# EAGLE design distribution_board (EAGLE 6.4)
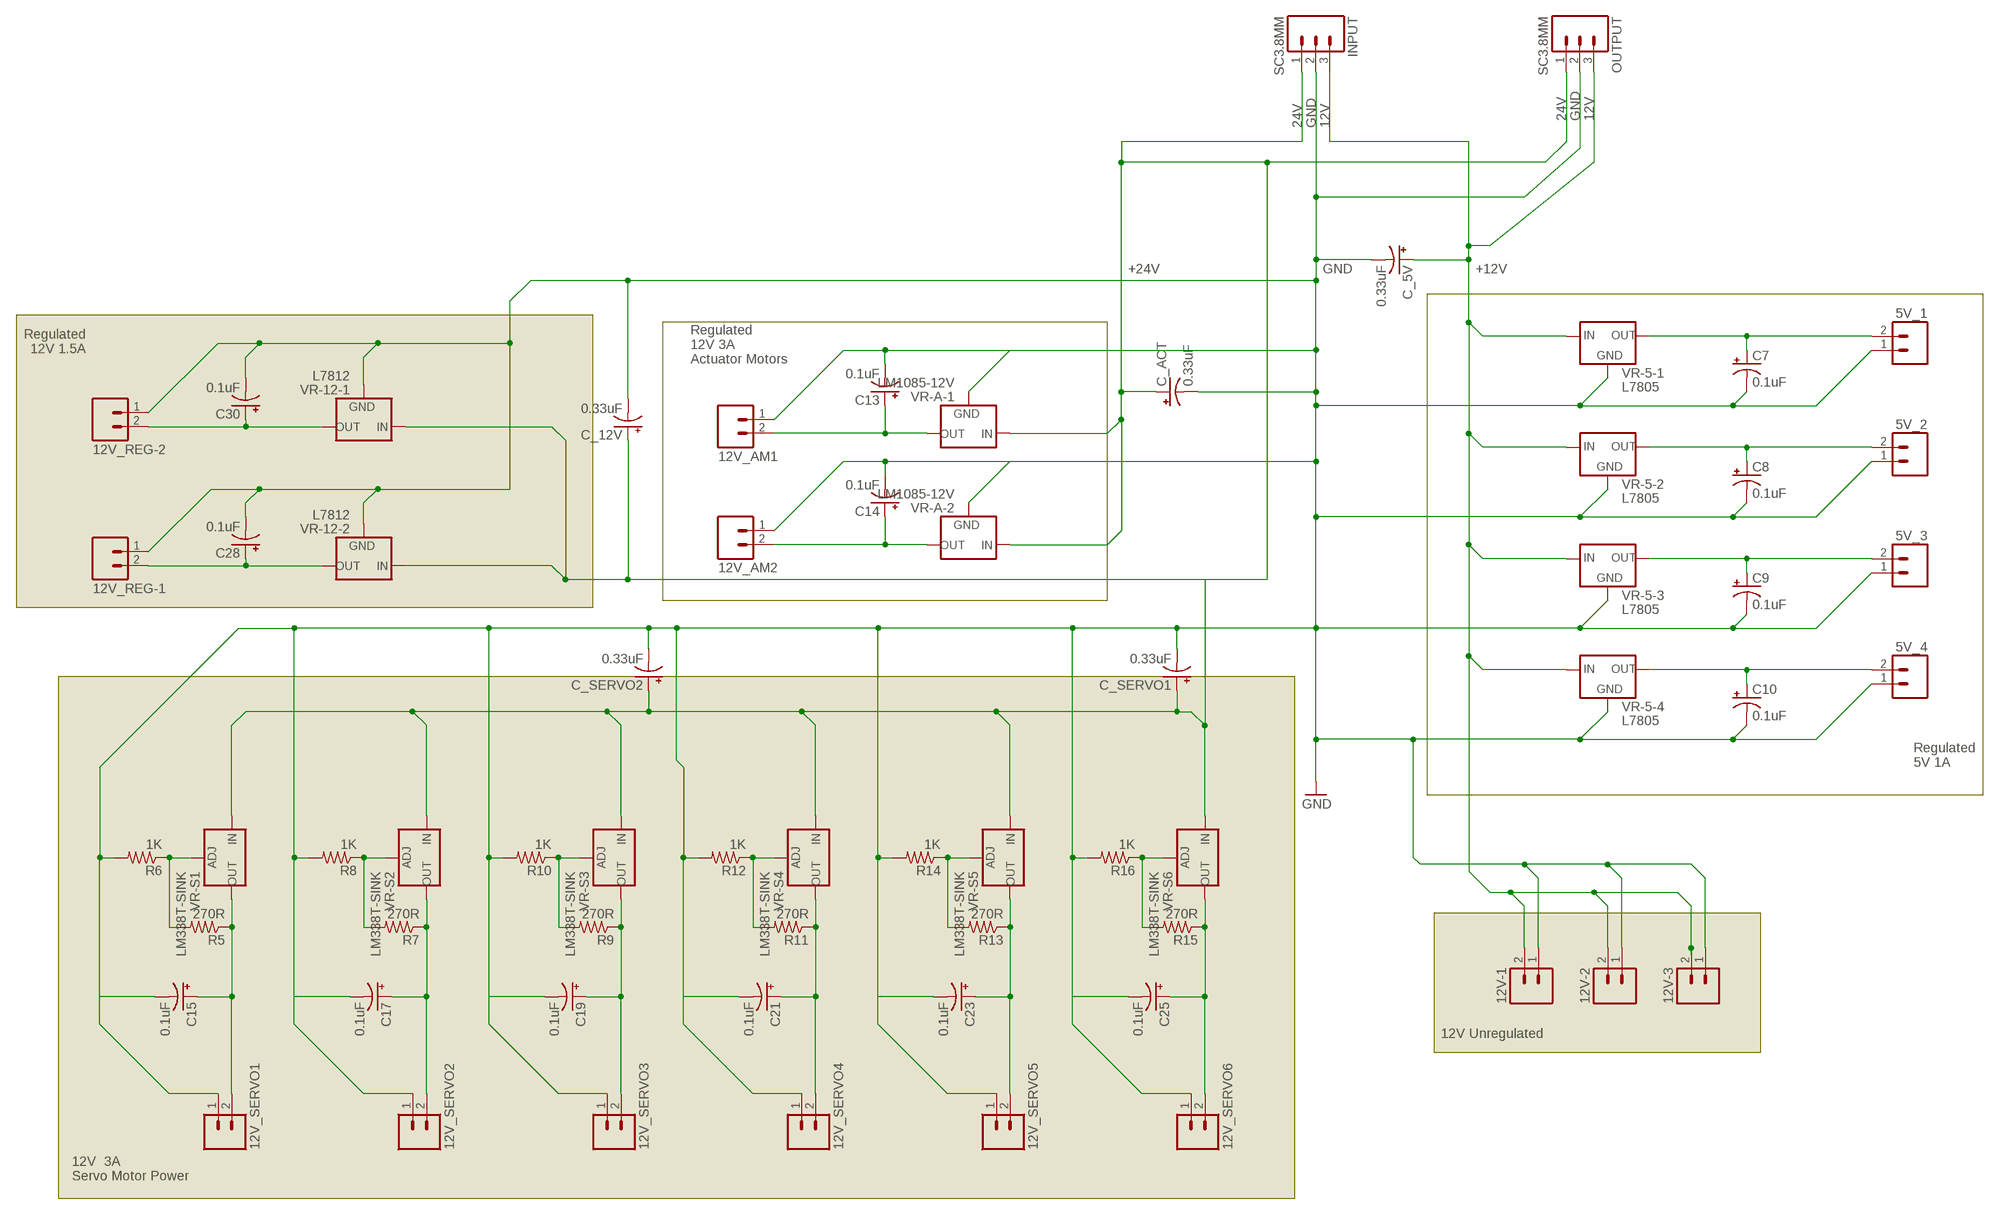
[diagram p0: schematic, sheet 1]

## Parts
5V_1  SC3.81MM  2-HOLESSC3.81MM  [SCREWTERMINAL-3.81MM]
5V_2  SC3.81MM  2-HOLESSC3.81MM  [SCREWTERMINAL-3.81MM]
5V_3  SC3.81MM  2-HOLESSC3.81MM  [SCREWTERMINAL-3.81MM]
5V_4  SC3.81MM  2-HOLESSC3.81MM  [SCREWTERMINAL-3.81MM]
12V-1  SC3.81MM  2-HOLESSC3.81MM  [SCREWTERMINAL-3.81MM]
12V-2  SC3.81MM  2-HOLESSC3.81MM  [SCREWTERMINAL-3.81MM]
12V-3  SC3.81MM  2-HOLESSC3.81MM  [SCREWTERMINAL-3.81MM]
12V_AM1  SC3.81MM  2-HOLESSC3.81MM  [SCREWTERMINAL-3.81MM]
12V_AM2  SC3.81MM  2-HOLESSC3.81MM  [SCREWTERMINAL-3.81MM]
12V_REG-1  SC3.81MM  2-HOLESSC3.81MM  [SCREWTERMINAL-3.81MM]
12V_REG-2  SC3.81MM  2-HOLESSC3.81MM  [SCREWTERMINAL-3.81MM]
12V_SERVO1  SC3.81MM  2-HOLESSC3.81MM  [SCREWTERMINAL-3.81MM]
12V_SERVO2  SC3.81MM  2-HOLESSC3.81MM  [SCREWTERMINAL-3.81MM]
12V_SERVO3  SC3.81MM  2-HOLESSC3.81MM  [SCREWTERMINAL-3.81MM]
12V_SERVO4  SC3.81MM  2-HOLESSC3.81MM  [SCREWTERMINAL-3.81MM]
12V_SERVO5  SC3.81MM  2-HOLESSC3.81MM  [SCREWTERMINAL-3.81MM]
12V_SERVO6  SC3.81MM  2-HOLESSC3.81MM  [SCREWTERMINAL-3.81MM]
C7  0.1uF  CAPACITOR_POL  [E2,5-5]
C8  0.1uF  CAPACITOR_POL  [E2,5-5]
C9  0.1uF  CAPACITOR_POL  [E2,5-5]
C10  0.1uF  CAPACITOR_POL  [E2,5-5]
C13  0.1uF  CAPACITOR_POL  [E2,5-5]
C14  0.1uF  CAPACITOR_POL  [E2,5-5]
C15  0.1uF  CAPACITOR_POL  [E2,5-5]
C17  0.1uF  CAPACITOR_POL  [E2,5-5]
C19  0.1uF  CAPACITOR_POL  [E2,5-5]
C21  0.1uF  CAPACITOR_POL  [E2,5-5]
C23  0.1uF  CAPACITOR_POL  [E2,5-5]
C25  0.1uF  CAPACITOR_POL  [E2,5-5]
C28  0.1uF  CAPACITOR_POL  [E2,5-5]
C30  0.1uF  CAPACITOR_POL  [E2,5-5]
C_5V  0.33uF  CAPACITOR_POL  [E2,5-5]
C_12V  0.33uF  CAPACITOR_POL  [E2,5-5]
C_ACT  0.33uF  CAPACITOR_POL  [E2,5-5]
C_SERVO1  0.33uF  CAPACITOR_POL  [E2,5-5]
C_SERVO2  0.33uF  CAPACITOR_POL  [E2,5-5]
INPUT  SC3.8MM  3-HOLES  [SCREWTERMINAL-5MM-3]
OUTPUT  SC3.8MM  3-HOLES  [SCREWTERMINAL-5MM-3]
R5  270R  RESISTOR0207/2V  [0207/2V]
R6  1K  RESISTOR0207/2V  [0207/2V]
R7  270R  RESISTOR0207/2V  [0207/2V]
R8  1K  RESISTOR0207/2V  [0207/2V]
R9  270R  RESISTOR0207/2V  [0207/2V]
R10  1K  RESISTOR0207/2V  [0207/2V]
R11  270R  RESISTOR0207/2V  [0207/2V]
R12  1K  RESISTOR0207/2V  [0207/2V]
R13  270R  RESISTOR0207/2V  [0207/2V]
R14  1K  RESISTOR0207/2V  [0207/2V]
R15  270R  RESISTOR0207/2V  [0207/2V]
R16  1K  RESISTOR0207/2V  [0207/2V]
VR-5-1  L7805  L7805ACD2T-TR  [TO263]
VR-5-2  L7805  L7805ACD2T-TR  [TO263]
VR-5-3  L7805  L7805ACD2T-TR  [TO263]
VR-5-4  L7805  L7805ACD2T-TR  [TO263]
VR-12-1  L7812  L7812CD2T-TRTO-263  [TO263]
VR-12-2  L7812  L7812CD2T-TRTO-263  [TO263]
VR-A-1  LM1085-12V  LM1085IT-SINK  [TO220V-HEATSINK]
VR-A-2  LM1085-12V  LM1085IT-SINK  [TO220V-HEATSINK]
VR-S1  LM338T-SINK  [TO220V-HEATSINK]
VR-S2  LM338T-SINK  [TO220V-HEATSINK]
VR-S3  LM338T-SINK  [TO220V-HEATSINK]
VR-S4  LM338T-SINK  [TO220V-HEATSINK]
VR-S5  LM338T-SINK  [TO220V-HEATSINK]
VR-S6  LM338T-SINK  [TO220V-HEATSINK]

## Nets
12V [power]: 12V-1.2 12V-2.2 12V-3.2 C_5V.+ INPUT.3 OUTPUT.3 VR-5-1.1(IN) VR-5-2.1(IN) VR-5-3.1(IN) VR-5-4.1(IN)
24V [power]: C_12V.+ C_ACT.+ C_SERVO1.+ C_SERVO2.+ INPUT.1 OUTPUT.1 VR-12-1.1(IN) VR-12-2.1(IN) VR-A-1.3(IN) VR-A-2.3(IN) VR-S1.3(IN) VR-S2.3(IN) VR-S3.3(IN) VR-S4.3(IN) VR-S5.3(IN) VR-S6.3(IN)
GND [ground]: 5V_1.1 5V_2.1 5V_3.1 5V_4.1 12V-1.1 12V-2.1 12V-3.1 12V_AM1.1 12V_AM2.1 12V_REG-1.1 12V_REG-2.1 12V_SERVO1.1 12V_SERVO2.1 12V_SERVO3.1 12V_SERVO4.1 12V_SERVO5.1 12V_SERVO6.1 C7.- C8.- C9.- C10.- C13.- C14.- C15.- C17.- C19.- C21.- C23.- C25.- C28.- C30.- C_5V.- C_12V.- C_ACT.- C_SERVO1.- C_SERVO2.- INPUT.2 OUTPUT.2 R6.2 R8.2 R10.2 R12.2 R14.2 R16.2 VR-5-1.3(GND) VR-5-2.3(GND) VR-5-3.3(GND) VR-5-4.3(GND) VR-12-1.3(GND) VR-12-2.3(GND) VR-A-1.1(GND) VR-A-2.1(GND)
N$3 [power]: 12V_REG-1.2 C28.+ VR-12-2.2(OUT)
N$7 [power]: 5V_1.2 C7.+ VR-5-1.2(OUT)
N$13 [power]: 5V_2.2 C8.+ VR-5-2.2(OUT)
N$14 [power]: 5V_3.2 C9.+ VR-5-3.2(OUT)
N$15 [power]: 5V_4.2 C10.+ VR-5-4.2(OUT)
N$17: 12V_AM1.2 C13.+ VR-A-1.2(OUT)
N$18 [power]: 12V_AM2.2 C14.+ VR-A-2.2(OUT)
N$19: R5.2 R6.1 VR-S1.1(ADJ)
N$21 [power]: 12V_REG-2.2 C30.+ VR-12-1.2(OUT)
N$23 [power]: 12V_SERVO1.2 C15.+ R5.1 VR-S1.2(OUT)
N$25 [power]: 12V_SERVO2.2 C17.+ R7.1 VR-S2.2(OUT)
N$26: R7.2 R8.1 VR-S2.1(ADJ)
N$28 [power]: 12V_SERVO3.2 C19.+ R9.1 VR-S3.2(OUT)
N$29: R9.2 R10.1 VR-S3.1(ADJ)
N$31 [power]: 12V_SERVO4.2 C21.+ R11.1 VR-S4.2(OUT)
N$32: R11.2 R12.1 VR-S4.1(ADJ)
N$34 [power]: 12V_SERVO5.2 C23.+ R13.1 VR-S5.2(OUT)
N$35: R13.2 R14.1 VR-S5.1(ADJ)
N$37 [power]: 12V_SERVO6.2 C25.+ R15.1 VR-S6.2(OUT)
N$38: R15.2 R16.1 VR-S6.1(ADJ)

## Notes on the sheet
- +24V | GND | +12V
- Regulated
  12V 1.5A
- Regulated
  12V 3A
  Actuator Motors
- Regulated
  5V 1A
- 12V Unregulated
- 12V  3A
  Servo Motor Power

## Library data of the parts
5V_1-5V_4 12V-1-12V-3 12V_AM1 12V_AM2 12V_REG-1 12V_REG-2 12V_SERVO1-12V_SERVO6 = parts:2-HOLES: TERMINAL 2-PIN Holes for connecting 2 pin terminal
C7-C10 C13-C15 C17 C19 C21 C23 C25 C28 C30 C_5V C_12V C_ACT C_SERVO1 C_SERVO2 = parts:CAPACITOR_POL: POLARIZED CAPACITOR, American symbol
INPUT OUTPUT = parts:3-HOLES: TERMINAL 3-PIN
R5-R16 = parts:RESISTOR: RESISTOR
VR-5-1-VR-5-4 = parts:L7805ACD2T-TR: VOLTAGE REGULATOR 5V 1A surface mount voltage regulator
VR-12-1 VR-12-2 = parts:L7812CD2T-TR: VOLTAGE REGULATOR 12V 1.5A voltage regulator
VR-A-1 VR-A-2 = parts:LM1085IT: VOLTAGE REGULATOR 12V 3A voltage regulator
VR-S1-VR-S6 = parts:LM338T: VOLTAGE REGULATOR Adjustable 1.2V to 32V 5A voltage regulator

## Net classes
1 ground: width 0.813 mm, clearance 0.508 mm
2 power: width 0.61 mm, clearance 0.508 mm

## Board
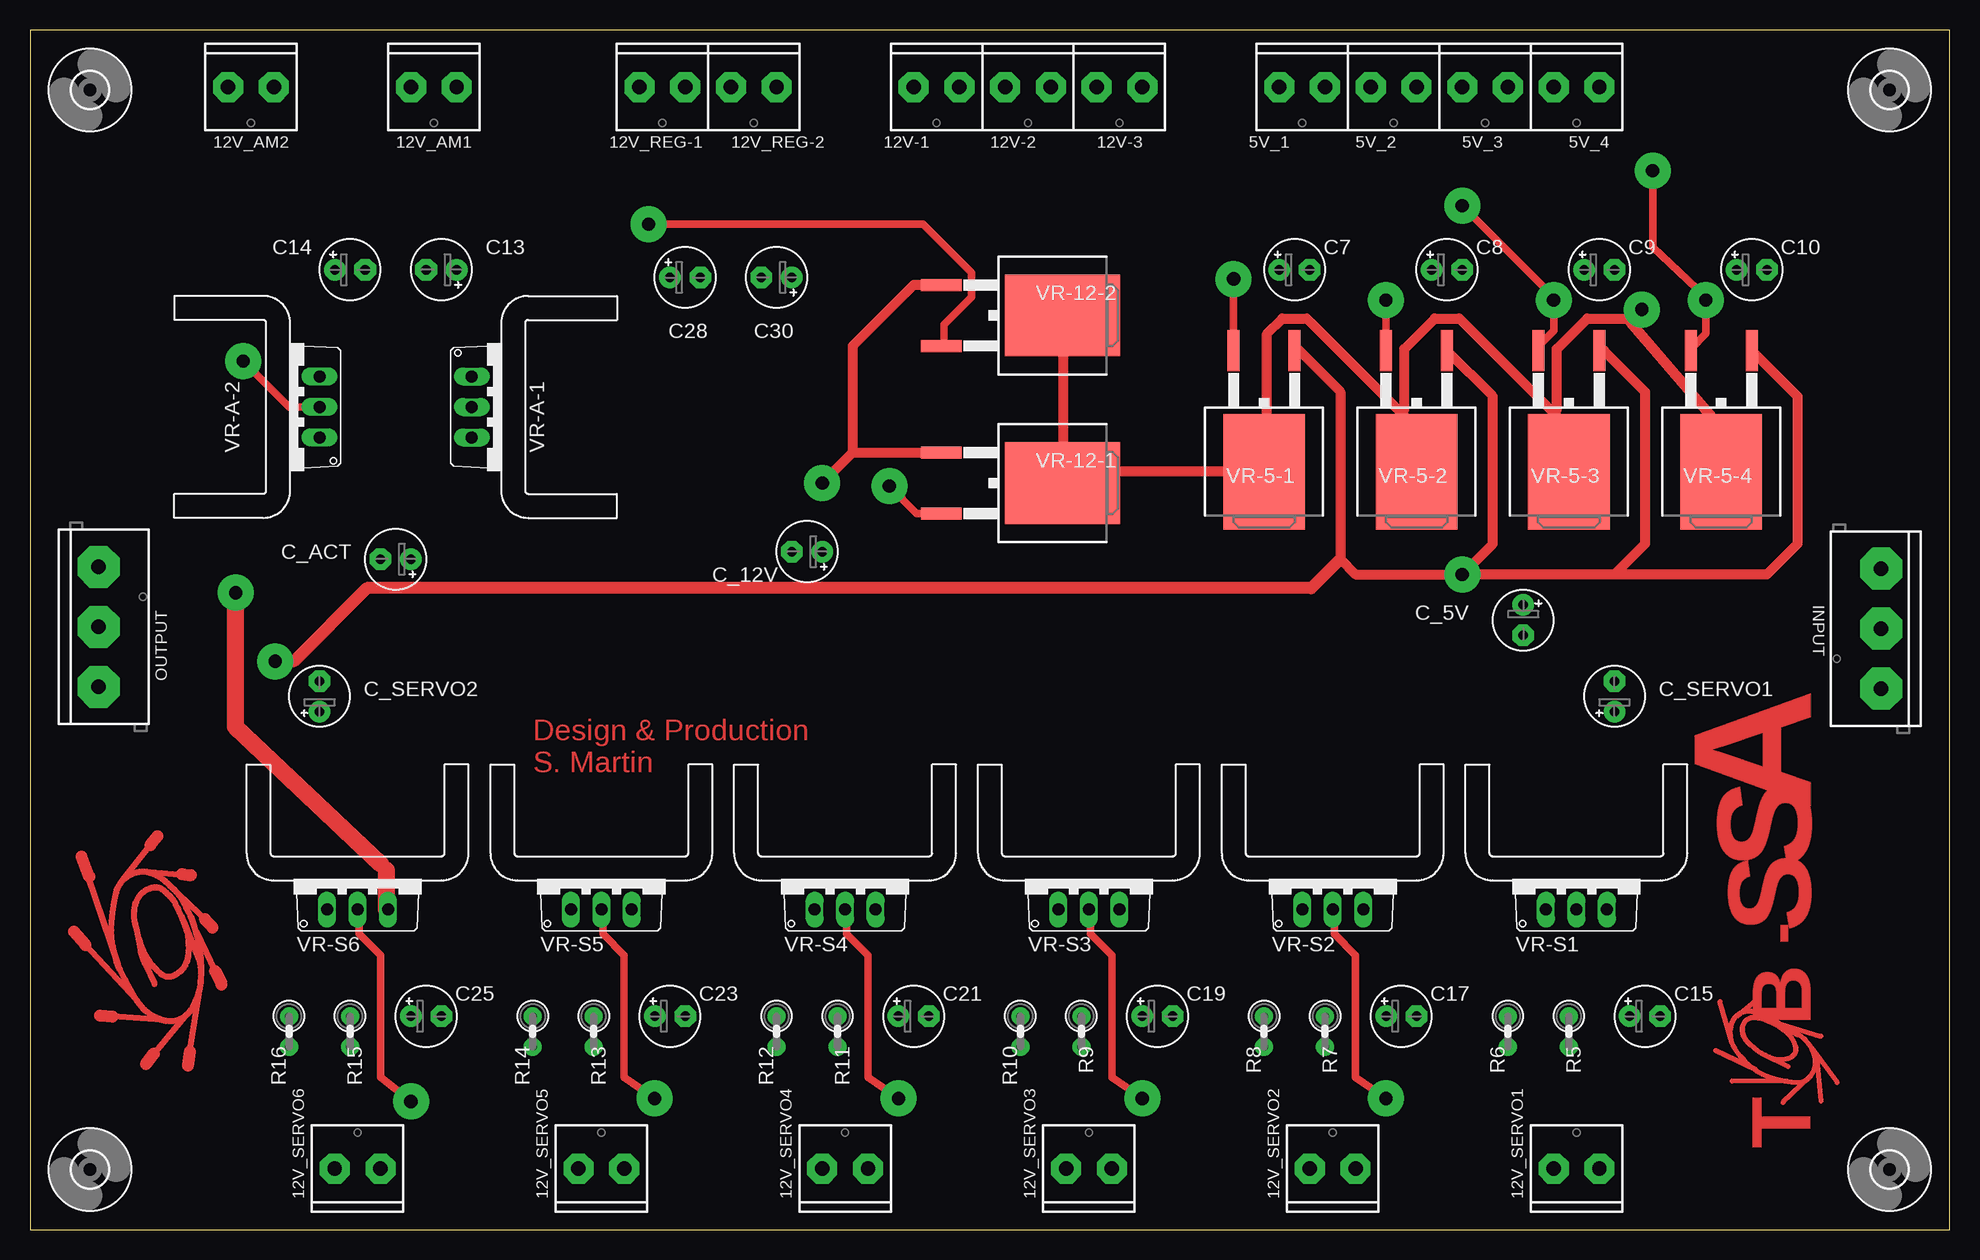
[diagram p1: board, top side]
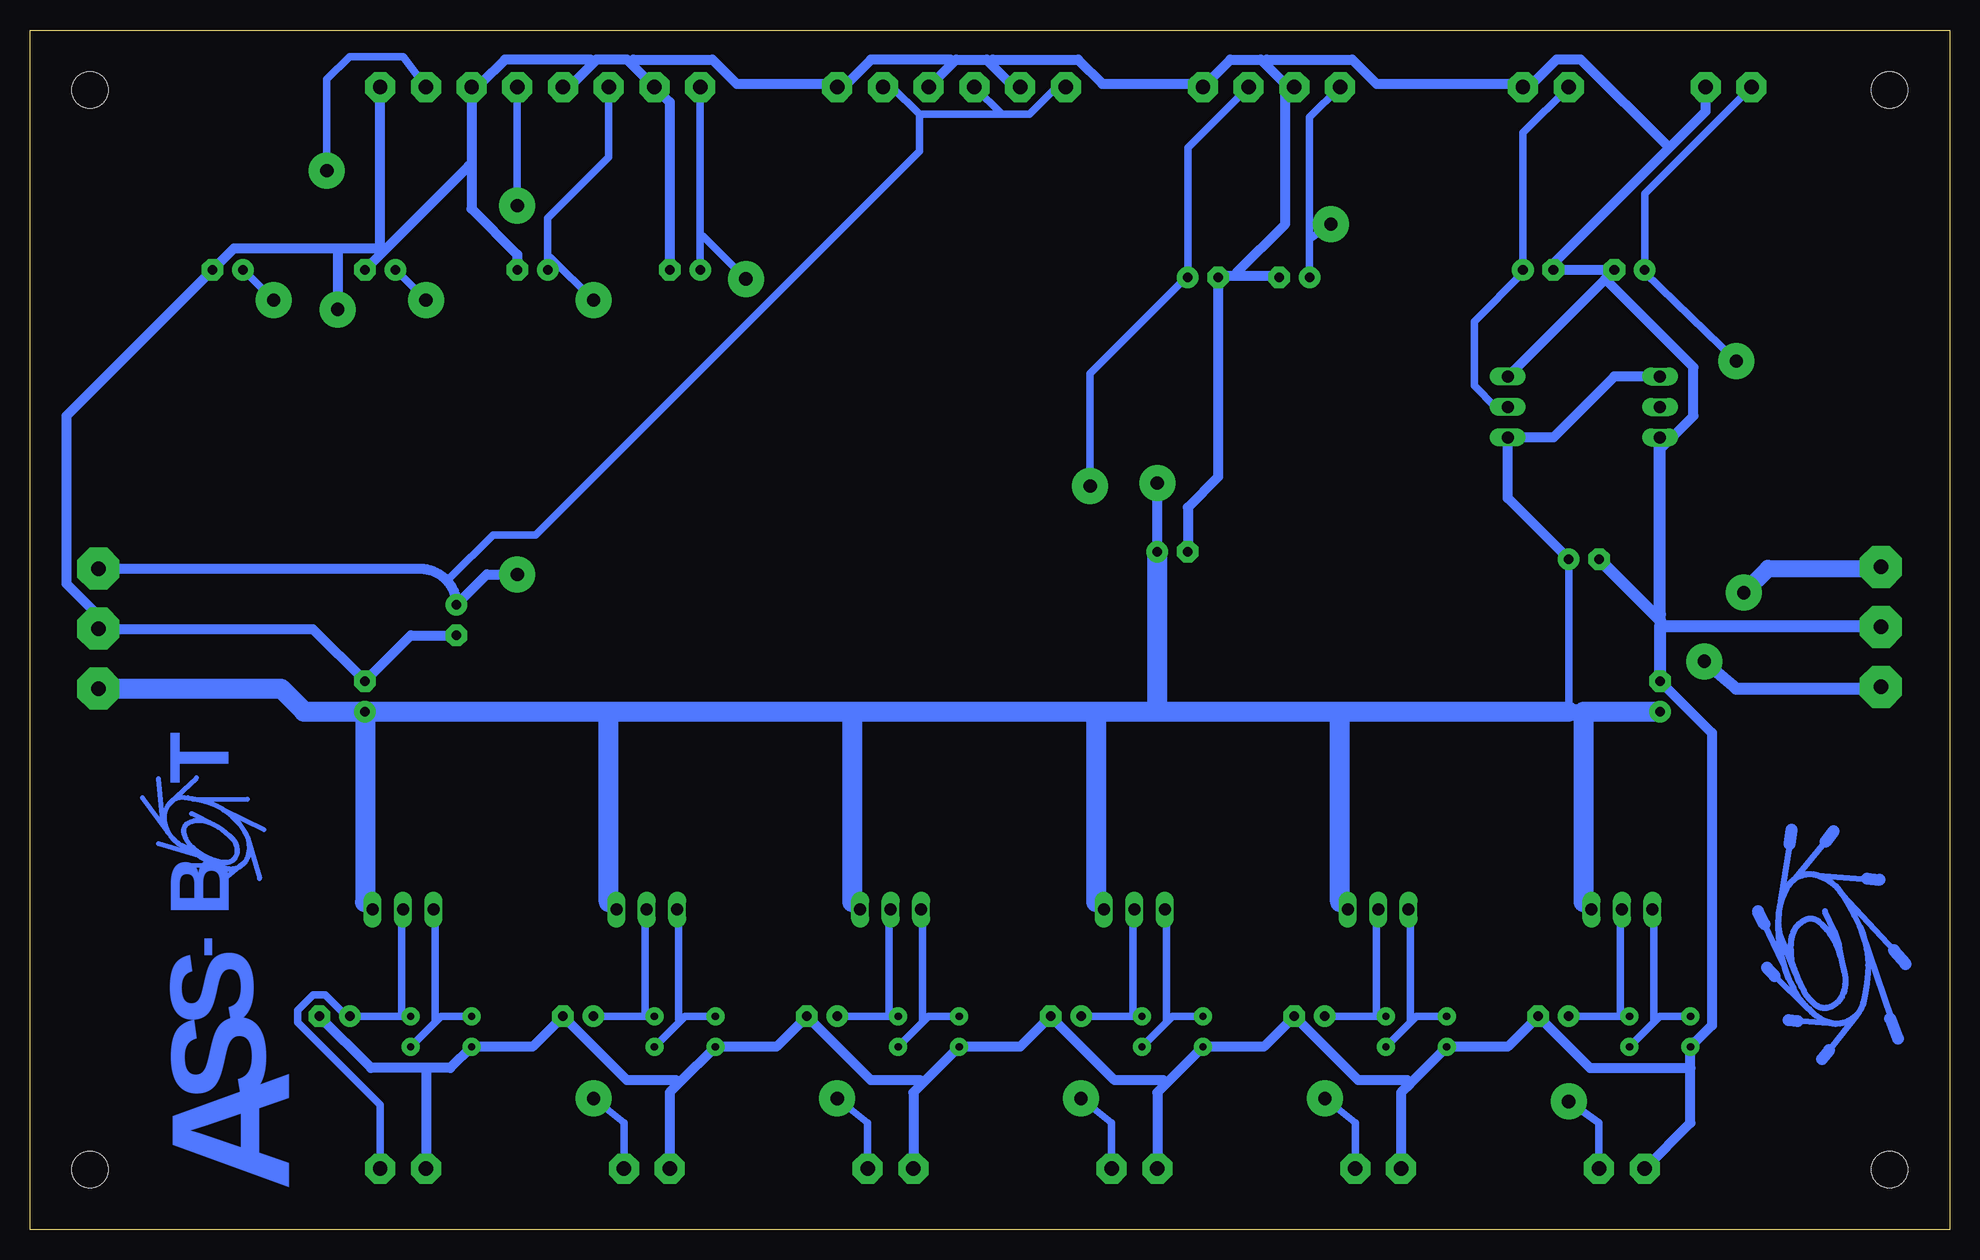
[diagram p2: board, bottom side, seen from below]

Size 160 x 100 mm. Coordinates in mm from the lower left corner, seen from the top.
Outline: 0,0 160,0 160,100 0,100 0,0
Copper layers (1*16): Top 0.035mm / dielectric 1.5mm / Bottom 0.035mm
Design rules "rules *": minimum track width 24mil, minimum drill 1.1mm, track to track 20mil, track to pad 20mil, pad to pad 30mil, via to via 50mil, smd to smd 8mil, copper to edge 40mil, drill to drill 8mil, minimum pad ring 10mil, minimum via ring 20mil, stop-mask expansion 4mil, vias tented up to drill 0mil, thermal gap 10mil

### Footprints (pad centres in the part's own frame; a part is rotated, then mirrored left to right if it is on the bottom)
SCREWTERMINAL-3.81MM = drill 1.2 pad 2.5 octagon: 1 0,0; 2 3.81,0
E2,5-5 = drill 0.8 pad 1.8: + -1.27,0 | drill 0.8 pad 1.8 octagon: - 1.27,0
SCREWTERMINAL-5MM-3 = drill 1.2 pad 3.5 octagon: 1 0,0; 2 5,0; 3 10,0
0207/2V = drill 0.6 pad 1.5: 1 -1.27,0; 2 1.27,0
3,0 = hole 3: 0,0
TO263 = smd 1 x 3.4: 1 -2.54,-6.6; 2 2.54,-6.6 | smd 6.8 x 9.6: 3 0,3.5
TO220V-HEATSINK = drill 1 long: 1 -2.54,-2.54; 2 0,-2.54; 3 2.54,-2.54

### Placement (x,y rotation side)
5V_1  107.95,95.25 180 top
5V_2  115.57,95.25 180 top
5V_3  123.19,95.25 180 top
5V_4  130.81,95.25 180 top
12V-1  77.47,95.25 180 top
12V-2  85.09,95.25 180 top
12V-3  92.71,95.25 180 top
12V_AM1  35.56,95.25 180 top
12V_AM2  20.32,95.25 180 top
12V_REG-1  54.61,95.25 180 top
12V_REG-2  62.23,95.25 180 top
12V_SERVO1  127,5.08 0 top
12V_SERVO2  106.68,5.08 0 top
12V_SERVO3  86.36,5.08 0 top
12V_SERVO4  66.04,5.08 0 top
12V_SERVO5  45.72,5.08 0 top
12V_SERVO6  25.4,5.08 0 top
C7  105.41,80.01 0 top
C8  118.11,80.01 0 top
C9  130.81,80.01 0 top
C10  143.51,80.01 0 top
C13  34.29,80.01 180 top
C14  26.67,80.01 0 top
C15  134.62,17.78 0 top
C17  114.3,17.78 0 top
C19  93.98,17.78 0 top
C21  73.66,17.78 0 top
C23  53.34,17.78 0 top
C25  33.02,17.78 0 top
C28  54.61,79.38 0 top
C30  62.23,79.38 180 top
C_5V  124.46,50.8 270 top
C_12V  64.77,56.52 180 top
C_ACT  30.48,55.88 180 top
C_SERVO1  132.08,44.45 90 top
C_SERVO2  24.13,44.45 90 top
INPUT  154.31,45.09 90 top
OUTPUT  5.71,55.24 270 top
R5  128.27,16.51 270 top
R6  123.19,16.51 270 top
R7  107.95,16.51 270 top
R8  102.87,16.51 270 top
R9  87.63,16.51 270 top
R10  82.55,16.51 270 top
R11  67.31,16.51 270 top
R12  62.23,16.51 270 top
R13  46.99,16.51 270 top
R14  41.91,16.51 270 top
R15  26.67,16.51 270 top
R16  21.59,16.51 270 top
U$1  [LOGO-ASSBOT]  138.43,3.17 90 bottom
U$2  [LOGO-SYNCHROTRON]  10.79,24.13 270 top
U$3  [LOGO-ASSBOT]  138.43,45.09 270 top
U$4  [LOGO-SYNCHROTRON]  10.79,22.86 90 bottom
U$5  [LOGO-ASSBOT-SILK]  78.74,41.27 0 top
U$6  [3,0]  5,95 0 top
U$7  [3,0]  155,95 0 top
U$8  [3,0]  5,5 0 top
U$9  [3,0]  155,5 0 top
VR-5-1  102.87,66.67 180 top
VR-5-2  115.57,66.67 180 top
VR-5-3  128.27,66.67 180 top
VR-5-4  140.97,66.67 180 top
VR-12-1  82.55,62.23 270 top
VR-12-2  82.55,76.2 270 top
VR-A-1  39.37,68.58 270 top
VR-A-2  21.59,68.58 90 top
VR-S1  128.91,29.21 0 top
VR-S2  108.58,29.21 0 top
VR-S3  88.27,29.21 0 top
VR-S4  67.94,29.21 0 top
VR-S5  47.62,29.21 0 top
VR-S6  27.3,29.21 0 top

### Tracks (layer width: path | path; a pad name or v marks a point on that pad's centre or on a via)
12V  (via drill 1.1, 1.1 pad 3)
  Top 0.813: v119.38,54.61 121.92,57.15 121.92,69.47 VR-5-2.1 | VR-5-1.1 105.8,73.28 109.22,69.85 109.22,55.88 110.49,54.61 v119.38,54.61 | VR-5-3.1 131.19,73.28 134.62,69.85 134.62,57.15 132.08,54.61 | 132.08,54.61 v119.38,54.61 | VR-5-4.1 147.32,69.47 147.32,57.15 144.78,54.61 132.08,54.61
  Top 1.016: v20.45,47.37 21.97,47.37 28.07,53.47 106.81,53.47 109.22,55.88
  Bottom 0.61: 12V-1.2 74.42,95.25 76.71,92.96 78.99,92.96 | 12V-2.2 78.99,92.96 | 12V-3.2 88.14,95.25 85.85,92.96 | 78.99,92.96 85.85,92.96 | 5.71,45.09 OUTPUT.3 | 85.85,92.96 85.85,89.92 117.86,57.91 121.41,57.91 124.97,54.36 125.25,54.1
  Bottom 0.813: v119.38,54.61 121.92,54.61 C_5V.+ arc-42 125.25,54.1 arc-48 127.47,55.09 INPUT.3
  Bottom 1.016: v20.45,47.37 17.78,45.09 5.71,45.09
24V  (via drill 1.1, 1.1 pad 3)
  Top 0.61: 29.72,29.97 29.21,30.48 | 29.72,26.67 VR-S6.3
  Top 0.813: v66.04,62.23 68.58,64.77 | 68.58,64.77 VR-12-1.1 | VR-12-2.1 73.66,78.74 68.58,73.66 68.58,64.77
  Top 1.422: v17.14,53.09 17.14,41.91 29.21,30.48 | 29.72,26.67 29.72,29.97
  Bottom 0.61: 5.84,55.12 OUTPUT.1 | 31.75,43.18 C_ACT.+
  Bottom 0.813: C_12V.+ v66.04,62.23 | C_ACT.+ 36.83,60.96 VR-A-1.3 33.02,66.04 27.94,71.12 VR-A-2.3
  Bottom 1.27: 31.75,43.18 30.48,43.18 | 132.08,27.3 VR-S1.3 | VR-S2.3 111.76,27.3 | VR-S3.3 91.44,27.3 | VR-S4.3 71.12,27.3 | VR-S5.3 50.8,27.3 | VR-S6.3 30.48,27.3
  Bottom 1.422: 5.84,55.12 15.11,55.12 v17.14,53.09
  Bottom 1.676: INPUT.1 139.06,45.09 137.16,43.18 C_SERVO1.+ | C_SERVO1.+ 111.76,43.18 | 111.76,43.18 91.44,43.18 | 91.44,43.18 71.12,43.18 | 71.12,43.18 66.04,43.18 | 66.04,43.18 50.8,43.18 | 50.8,43.18 31.75,43.18 | C_SERVO2.+ 30.48,43.18 30.48,27.3 | C_SERVO1.+ 132.08,27.3 | 111.76,27.3 111.76,43.18 | 91.44,27.3 91.44,43.18 | 71.12,27.3 71.12,43.18 | 50.8,27.3 50.8,43.18 | 66.04,43.18 C_12V.+
GND  (via drill 1.1 pad 3)
  Top 0.813: VR-12-2.3 86.11,76.2 86.11,62.23 VR-12-1.3 86.36,63.25 102.87,63.25 VR-5-1.3 103.12,63.5 103.12,74.68 104.39,75.95 106.43,75.95 114.3,68.07 | VR-5-2.3 115.57,66.8 114.3,68.07 | VR-5-3.3 128.27,66.8 127,68.07 | 127,68.07 119.13,75.95 117.09,75.95 114.55,73.41 114.55,68.33 114.3,68.07 | VR-5-4.3 140.97,66.8 133.35,75.69 | 133.35,75.69 133.1,75.95 129.79,75.95 127.25,73.41 127.25,68.33 127,68.07 | v134.37,76.71 133.35,75.69
  Bottom 0.813: C15.- 131.57,13.46 127,13.46 | 127,13.46 124.97,13.46 R6.2 118.11,15.24 C17.- 110.24,12.45 106.17,12.45 105.92,12.19 | 127,13.46 12V_SERVO1.1 | 12V_SERVO2.1 106.68,11.43 105.92,12.19 | 105.92,12.19 R8.2 97.79,15.24 C19.- 89.92,12.45 85.85,12.45 85.6,12.19 | 12V_SERVO3.1 86.36,11.43 85.6,12.19 | 85.6,12.19 R10.2 77.47,15.24 C21.- 69.6,12.45 65.53,12.45 65.28,12.19 | 12V_SERVO4.1 66.04,11.43 65.28,12.19 | 65.28,12.19 R12.2 57.15,15.24 C23.- 49.28,12.45 45.21,12.45 44.96,12.19 | 21.59,13.46 21.59,8.89 12V_SERVO6.1 | 21.59,13.46 R16.2 19.81,17.02 19.81,41.4 C_SERVO2.- | 12V_SERVO5.1 45.72,11.43 44.96,12.19 | 44.96,12.19 R14.2 36.83,15.24 C25.- 29.97,13.46 21.59,13.46 | C_5V.- 128.27,49.53 C_SERVO1.- 136.4,50.04 154.18,50.04 INPUT.2 154.43,50.29 154.43,51.31 156.97,53.85 156.97,67.82 C10.- 143,81.79 134.37,81.79 | C8.- 119.38,81.28 123.19,85.09 123.19,88.65 | 123.19,88.65 5V_3.1 122.94,95.5 122.43,95.5 120.4,97.54 113.28,97.54 113.03,97.28 | 130.56,81.53 123.44,88.65 123.19,88.65 | 130.56,81.53 C9.- | 130.81,81.79 134.37,81.79 | 130.81,81.79 130.56,81.53 | 130.81,81.79 5V_4.1 | 134.37,81.79 v134.37,76.71 | 28.7,79.25 C14.- C13.- 33.27,80.26 23.37,90.17 | 28.7,79.25 VR-A-1.1 | 12V_AM2.1 20.32,93.22 23.37,90.17 | 23.37,90.17 30.73,97.54 32.77,97.54 35.05,95.25 12V_AM1.1 35.81,95.5 47.75,95.5 49.78,97.54 56.9,97.54 57.15,97.28 | 24.13,50.8 24.13,50.29 | 5.84,50.29 OUTPUT.2 | 28.7,79.25 21.34,71.88 21.34,67.82 23.88,65.28 VR-A-2.1 | 57.15,97.28 57.4,97.54 59.94,97.54 12V_REG-2.1 62.48,95.5 70.61,95.5 72.64,97.54 79.76,97.54 80.01,97.28 | 57.15,97.28 55.12,95.25 12V_REG-1.1 55.37,95 55.37,83.82 59.44,79.76 59.44,79.5
  Bottom 0.813: 59.44,79.5 60.96,79.5 C30.- 60.96,62.74 63.5,60.2 C_12V.- | 59.44,79.5 55.88,79.5 C28.- | 12V-1.1 77.98,95.25 80.01,97.28 | 80.01,97.28 80.26,97.54 82.8,97.54 83.06,97.28 | 12V-2.1 83.06,97.28 | 83.06,97.28 83.31,97.54 89.92,97.54 92.2,95.25 12V-3.1 92.96,95.5 101.09,95.5 103.12,97.54 109.73,97.54 109.98,97.28 | C7.- 106.68,93.98 5V_1.1 109.98,97.28 | 5V_2.1 115.06,95.25 113.03,97.28 | 113.03,97.28 112.78,97.54 110.24,97.54 109.98,97.28
  Bottom 1.016: C_SERVO2.- 24.13,50.29 5.84,50.29 | C_ACT.- 24.38,51.05 | 24.38,51.05 24.13,50.8 | VR-A-2.1 24.13,51.31 24.38,51.05
N$1  (via drill 1.1 pad 3)
  other vias: 66.04,62.23
N$2  (via drill 1.1 pad 3)
  other vias: 119.38,54.61
N$3  (via drill 1.1 pad 3)
  Top 0.61: v51.56,83.82 74.42,83.82 78.49,79.76 78.49,77.72 76.2,75.44 76.2,73.66 VR-12-2.2
  Bottom 0.61: 53.34,82.55 53.34,92.71 12V_REG-1.2 | 53.34,82.55 C28.+ | v51.56,83.82 53.34,82.55
N$7  (via drill 1.1 pad 3)
  Top 0.61: v100.33,79.25 VR-5-1.2
  Bottom 0.61: 5V_1.2 104.14,82.8 | 104.14,82.8 C7.+ | v100.33,79.25 103.89,82.8 104.14,82.8
N$13  (via drill 1.1 pad 3)
  Top 0.61: v113.03,77.47 VR-5-2.2
  Bottom 0.61: 116.84,81.03 116.84,84.33 111.76,89.41 5V_2.2 | 116.84,81.03 C8.+ | v113.03,77.47 116.59,81.03 116.84,81.03
N$14  (via drill 1.1 pad 3)
  Top 0.61: VR-5-3.2 125.73,73.66 127,74.93 v127,77.47 127,77.72 v119.38,85.34
  Bottom 0.61: v127,77.47 C9.+ | v119.38,85.34 5V_3.2
N$15  (via drill 1.1 pad 3)
  Top 0.61: VR-5-4.2 138.43,73.41 139.7,74.68 v139.7,77.47 139.7,77.72 135.25,81.92 v135.25,88.27
  Bottom 0.61: v139.7,77.47 C10.+ | v135.25,88.27 135.25,95.89 133.35,97.79 128.91,97.79 5V_4.2
N$17
  Bottom 0.61: 12V_AM1.2 35.56,91.44 C13.+ 35.56,79.76 39.62,75.69 39.62,70.36 37.85,68.58 VR-A-1.2
N$18  (via drill 1.1 pad 3)
  Top 0.61: v17.78,72.39 21.59,68.58 VR-A-2.2
  Bottom 0.61: 12V_AM2.2 25.4,86.36 C14.+ 25.4,79.76 v17.78,72.39
N$19
  Bottom 0.61: R6.1 125.73,17.78 126.11,17.4 | R5.2 126.11,17.4 | VR-S1.1 126.24,26.67 126.24,17.53 126.11,17.4
N$21  (via drill 1.1 pad 3)
  Top 0.61: VR-12-1.2 73.91,59.69 v71.63,61.98
  Bottom 0.61: 12V_REG-2.2 63.5,90.17 C30.+ 63.75,79.25 71.63,71.37 v71.63,61.98
N$23
  Bottom 0.61: 129.03,17.78 C15.+ 133.6,17.78 135.38,19.56 136.4,19.56 137.67,18.29 137.67,17.27 130.81,10.41 12V_SERVO1.2 | 129.03,17.78 R5.1 | 129.03,17.78 129.03,26.67 VR-S1.2
N$25  (via drill 1.1 pad 3)
  Top 0.61: v113.03,10.92 110.49,12.7 110.49,22.86 108.71,24.64 108.71,26.67 VR-S2.2
  Bottom 0.61: C17.+ 108.71,17.78 | 108.71,17.78 R7.1 | 108.71,17.78 108.71,26.67 VR-S2.2 | v113.03,10.92 110.49,8.89 12V_SERVO2.2
N$26
  Bottom 0.61: R8.1 105.41,17.78 105.79,17.4 | R7.2 105.79,17.4 | VR-S2.1 105.92,26.67 105.92,17.53 105.79,17.4
N$28  (via drill 1.1 pad 3)
  Top 0.61: v92.71,10.92 90.17,12.7 90.17,22.86 88.39,24.64 88.39,25.4 VR-S3.2
  Bottom 0.61: C19.+ 88.39,17.78 | 88.39,17.78 R9.1 | 88.39,17.78 88.39,26.67 VR-S3.2 | v92.71,10.92 90.17,8.89 12V_SERVO3.2
N$29
  Bottom 0.61: R10.1 85.09,17.78 85.47,17.4 | R9.2 85.47,17.4 | VR-S3.1 85.6,26.67 85.6,17.53 85.47,17.4
N$31  (via drill 1.1 pad 3)
  Top 0.61: v72.39,10.92 69.85,12.7 69.85,22.86 68.07,24.64 68.07,26.67 VR-S4.2
  Bottom 0.61: C21.+ 68.07,17.78 | 68.07,17.78 R11.1 | 68.07,17.78 68.07,25.4 VR-S4.2 | v72.39,10.92 69.85,8.89 12V_SERVO4.2
N$32
  Bottom 0.61: R12.1 64.77,17.78 65.15,17.4 | R11.2 65.15,17.4 | VR-S4.1 65.28,26.67 65.28,17.53 65.15,17.4
N$34  (via drill 1.1 pad 3)
  Top 0.61: v52.07,10.92 49.53,12.7 49.53,22.86 47.75,24.64 47.75,26.67 VR-S5.2
  Bottom 0.61: C23.+ 47.75,17.78 | 47.75,17.78 R13.1 | 47.75,17.78 47.75,26.67 VR-S5.2 | v52.07,10.92 49.53,8.89 12V_SERVO5.2
N$35
  Bottom 0.61: R14.1 44.45,17.78 44.83,17.4 | R13.2 44.83,17.4 | VR-S5.1 44.96,26.67 44.96,17.53 44.83,17.4
N$37  (via drill 1.1 pad 3)
  Top 0.61: v31.75,10.67 29.21,12.7 29.21,22.86 27.43,24.64 27.43,26.67 VR-S6.2
  Bottom 0.61: C25.+ 27.43,17.78 | 27.43,17.78 R15.1 | 27.43,17.78 27.43,26.67 VR-S6.2 | v31.75,10.67 29.21,8.89 12V_SERVO6.2
N$38
  Bottom 0.61: R16.1 24.13,17.78 24.51,17.4 | R15.2 24.51,17.4 | VR-S6.1 24.64,26.67 24.64,17.53 24.51,17.4

### Text on the board
Top: Design & Production / S. Martin
_tplace: ACT. M2 | ACT. M1 | 12V RAW | 12V REG | 5V REG | 12V | GND | 12V | GND | 12V | GND | 12V | GND | 12V | GND | 12V | GND | 12V | GND | 5V | GND | 5V | GND | 5V | GND | 5V | GND | Vout | Vin | 24V | 12V | GND | GND | 12V | POWER DISTRIBUTION / BOARD | 24V | GND | 6V | GND | 6V | GND | 6V | GND | 6V | GND | 6V | GND | 6V | SERVO 6 | SERVO 5 | SERVO 4 | SERVO 3 | SERVO 2 | SERVO 1